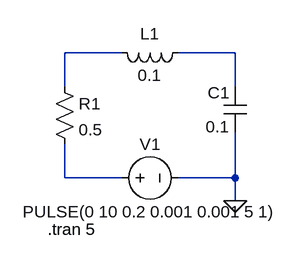
[diagram p0: schematic Draft3.asc]
Draft3.asc, the LTspice schematic file:
Version 4.1
SHEET 1 880 680
WIRE 160 48 80 48
WIRE 320 48 240 48
WIRE 80 96 80 48
WIRE 320 96 320 48
WIRE 80 224 80 176
WIRE 160 224 80 224
WIRE 320 224 320 160
WIRE 320 224 240 224
WIRE 320 256 320 224
FLAG 320 256 0
SYMBOL res 64 80 R0
SYMATTR InstName R1
SYMATTR Value 0.5
SYMBOL ind 256 32 R90
WINDOW 0 5 56 VBottom 2
WINDOW 3 32 56 VTop 2
SYMATTR InstName L1
SYMATTR Value 0.1
SYMBOL cap 336 160 R180
WINDOW 0 24 56 Left 2
WINDOW 3 24 8 Left 2
SYMATTR InstName C1
SYMATTR Value 0.1
SYMBOL voltage 144 224 R270
WINDOW 0 32 56 VTop 2
WINDOW 3 -32 56 VBottom 2
WINDOW 123 0 0 Left 0
WINDOW 39 0 0 Left 0
SYMATTR InstName V1
SYMATTR Value PULSE(0 10 0.2 0.001 0.001 5 1)
TEXT 56 296 Left 2 !.tran 5

The netlist it stands for:
* Draft3.asc
R1 N001 N003 0.5
L1 N002 N001 0.1
C1 0 N002 0.1
V1 N003 0 PULSE(0 10 0.2 0.001 0.001 5 1)
.tran 5
.backanno
.end